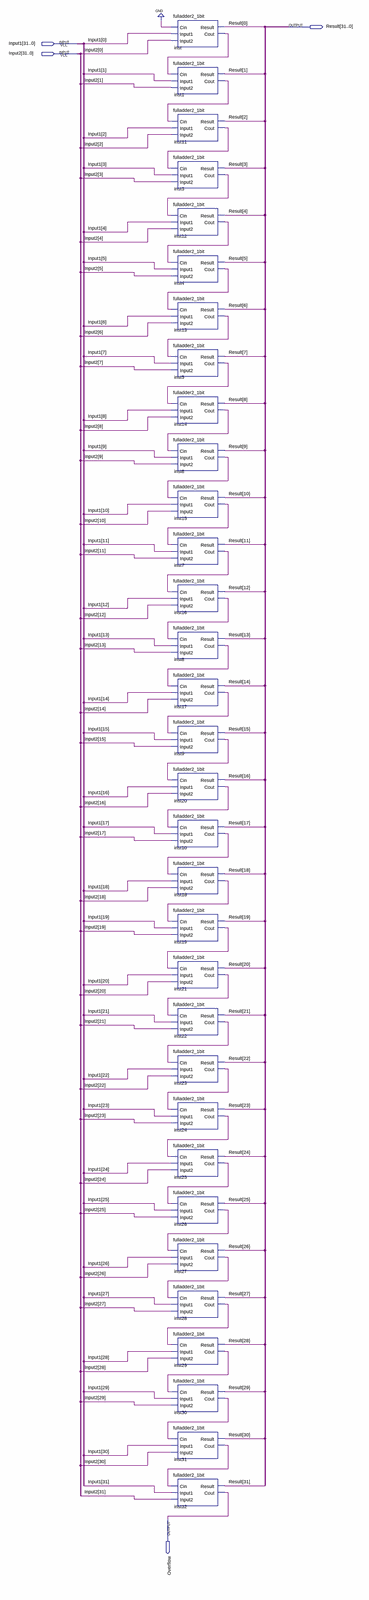
[diagram p0: schematic sheet, whole]
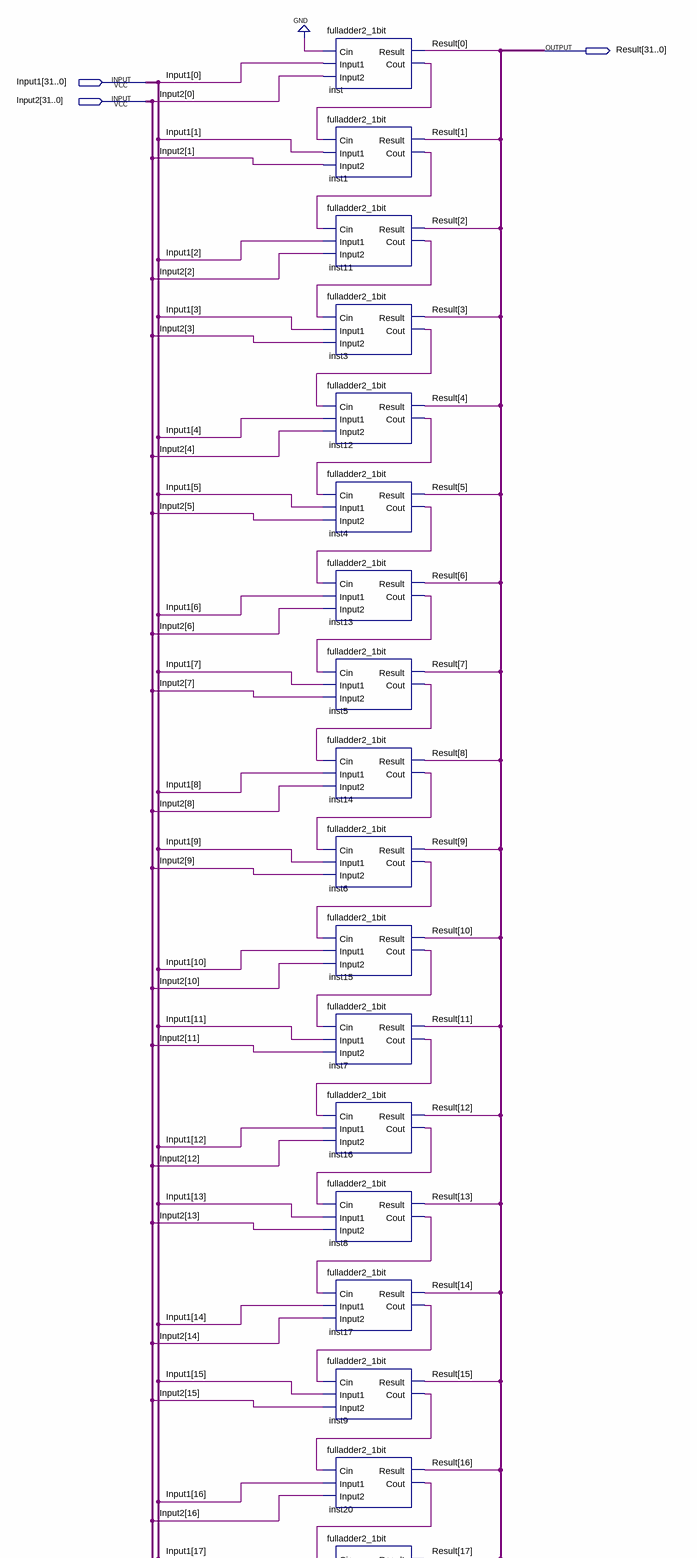
[diagram p1: schematic sheet, upper part]
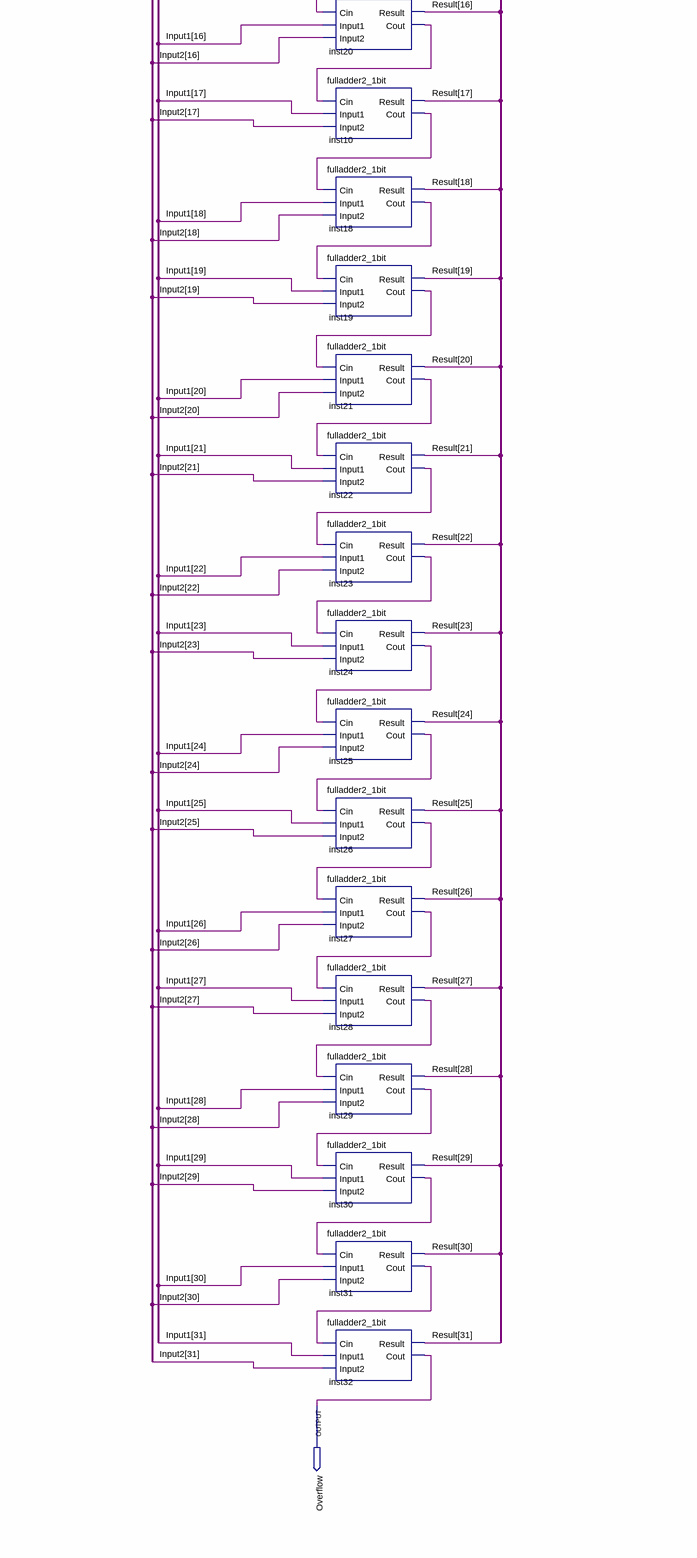
[diagram p2: schematic sheet, lower part]
// Quartus schematic fulladder2_32bit.bdf as structural Verilog: 32 symbols, 4 pins
module fulladder2_32bit (
  input  [31:0] Input1,
  input  [31:0] Input2,
  output [31:0] Result,
  output Overflow
);

  wire inst1_cout, inst3_cout, inst4_cout, inst5_cout, inst6_cout, inst7_cout, inst8_cout, inst9_cout,
       inst10_cout, inst11_cout, inst12_cout, inst13_cout, inst14_cout, inst15_cout, inst16_cout,
       inst17_cout, inst18_cout, inst19_cout, inst20_cout, inst21_cout, inst22_cout, inst23_cout,
       inst24_cout, inst25_cout, inst26_cout, inst27_cout, inst28_cout, inst29_cout, inst30_cout,
       inst31_cout, inst_cout;

  fulladder2_1bit inst (.Cin(1'b0), .Input1(Input1[0]), .Input2(Input2[0]), .Result(Result[0]), .Cout(inst_cout));
  fulladder2_1bit inst1 (
    .Cin(inst_cout), .Input1(Input1[1]), .Input2(Input2[1]), .Result(Result[1]), .Cout(inst1_cout));
  fulladder2_1bit inst11 (
    .Cin(inst1_cout), .Input1(Input1[2]), .Input2(Input2[2]), .Result(Result[2]), .Cout(inst11_cout));
  fulladder2_1bit inst3 (
    .Cin(inst11_cout), .Input1(Input1[3]), .Input2(Input2[3]), .Result(Result[3]), .Cout(inst3_cout));
  fulladder2_1bit inst12 (
    .Cin(inst3_cout), .Input1(Input1[4]), .Input2(Input2[4]), .Result(Result[4]), .Cout(inst12_cout));
  fulladder2_1bit inst4 (
    .Cin(inst12_cout), .Input1(Input1[5]), .Input2(Input2[5]), .Result(Result[5]), .Cout(inst4_cout));
  fulladder2_1bit inst13 (
    .Cin(inst4_cout), .Input1(Input1[6]), .Input2(Input2[6]), .Result(Result[6]), .Cout(inst13_cout));
  fulladder2_1bit inst5 (
    .Cin(inst13_cout), .Input1(Input1[7]), .Input2(Input2[7]), .Result(Result[7]), .Cout(inst5_cout));
  fulladder2_1bit inst14 (
    .Cin(inst5_cout), .Input1(Input1[8]), .Input2(Input2[8]), .Result(Result[8]), .Cout(inst14_cout));
  fulladder2_1bit inst6 (
    .Cin(inst14_cout), .Input1(Input1[9]), .Input2(Input2[9]), .Result(Result[9]), .Cout(inst6_cout));
  fulladder2_1bit inst15 (
    .Cin(inst6_cout), .Input1(Input1[10]), .Input2(Input2[10]), .Result(Result[10]), .Cout(inst15_cout));
  fulladder2_1bit inst7 (
    .Cin(inst15_cout), .Input1(Input1[11]), .Input2(Input2[11]), .Result(Result[11]), .Cout(inst7_cout));
  fulladder2_1bit inst16 (
    .Cin(inst7_cout), .Input1(Input1[12]), .Input2(Input2[12]), .Result(Result[12]), .Cout(inst16_cout));
  fulladder2_1bit inst8 (
    .Cin(inst16_cout), .Input1(Input1[13]), .Input2(Input2[13]), .Result(Result[13]), .Cout(inst8_cout));
  fulladder2_1bit inst17 (
    .Cin(inst8_cout), .Input1(Input1[14]), .Input2(Input2[14]), .Result(Result[14]), .Cout(inst17_cout));
  fulladder2_1bit inst9 (
    .Cin(inst17_cout), .Input1(Input1[15]), .Input2(Input2[15]), .Result(Result[15]), .Cout(inst9_cout));
  fulladder2_1bit inst20 (
    .Cin(inst9_cout), .Input1(Input1[16]), .Input2(Input2[16]), .Result(Result[16]), .Cout(inst20_cout));
  fulladder2_1bit inst10 (
    .Cin(inst20_cout), .Input1(Input1[17]), .Input2(Input2[17]), .Result(Result[17]), .Cout(inst10_cout));
  fulladder2_1bit inst18 (
    .Cin(inst10_cout), .Input1(Input1[18]), .Input2(Input2[18]), .Result(Result[18]), .Cout(inst18_cout));
  fulladder2_1bit inst19 (
    .Cin(inst18_cout), .Input1(Input1[19]), .Input2(Input2[19]), .Result(Result[19]), .Cout(inst19_cout));
  fulladder2_1bit inst21 (
    .Cin(inst19_cout), .Input1(Input1[20]), .Input2(Input2[20]), .Result(Result[20]), .Cout(inst21_cout));
  fulladder2_1bit inst22 (
    .Cin(inst21_cout), .Input1(Input1[21]), .Input2(Input2[21]), .Result(Result[21]), .Cout(inst22_cout));
  fulladder2_1bit inst23 (
    .Cin(inst22_cout), .Input1(Input1[22]), .Input2(Input2[22]), .Result(Result[22]), .Cout(inst23_cout));
  fulladder2_1bit inst24 (
    .Cin(inst23_cout), .Input1(Input1[23]), .Input2(Input2[23]), .Result(Result[23]), .Cout(inst24_cout));
  fulladder2_1bit inst25 (
    .Cin(inst24_cout), .Input1(Input1[24]), .Input2(Input2[24]), .Result(Result[24]), .Cout(inst25_cout));
  fulladder2_1bit inst26 (
    .Cin(inst25_cout), .Input1(Input1[25]), .Input2(Input2[25]), .Result(Result[25]), .Cout(inst26_cout));
  fulladder2_1bit inst27 (
    .Cin(inst26_cout), .Input1(Input1[26]), .Input2(Input2[26]), .Result(Result[26]), .Cout(inst27_cout));
  fulladder2_1bit inst28 (
    .Cin(inst27_cout), .Input1(Input1[27]), .Input2(Input2[27]), .Result(Result[27]), .Cout(inst28_cout));
  fulladder2_1bit inst29 (
    .Cin(inst28_cout), .Input1(Input1[28]), .Input2(Input2[28]), .Result(Result[28]), .Cout(inst29_cout));
  fulladder2_1bit inst30 (
    .Cin(inst29_cout), .Input1(Input1[29]), .Input2(Input2[29]), .Result(Result[29]), .Cout(inst30_cout));
  fulladder2_1bit inst31 (
    .Cin(inst30_cout), .Input1(Input1[30]), .Input2(Input2[30]), .Result(Result[30]), .Cout(inst31_cout));
  fulladder2_1bit inst32 (
    .Cin(inst31_cout), .Input1(Input1[31]), .Input2(Input2[31]), .Result(Result[31]), .Cout(Overflow));
endmodule
